# Altium project IMX8SoCIot.PrjPcb (part 1 of 9)
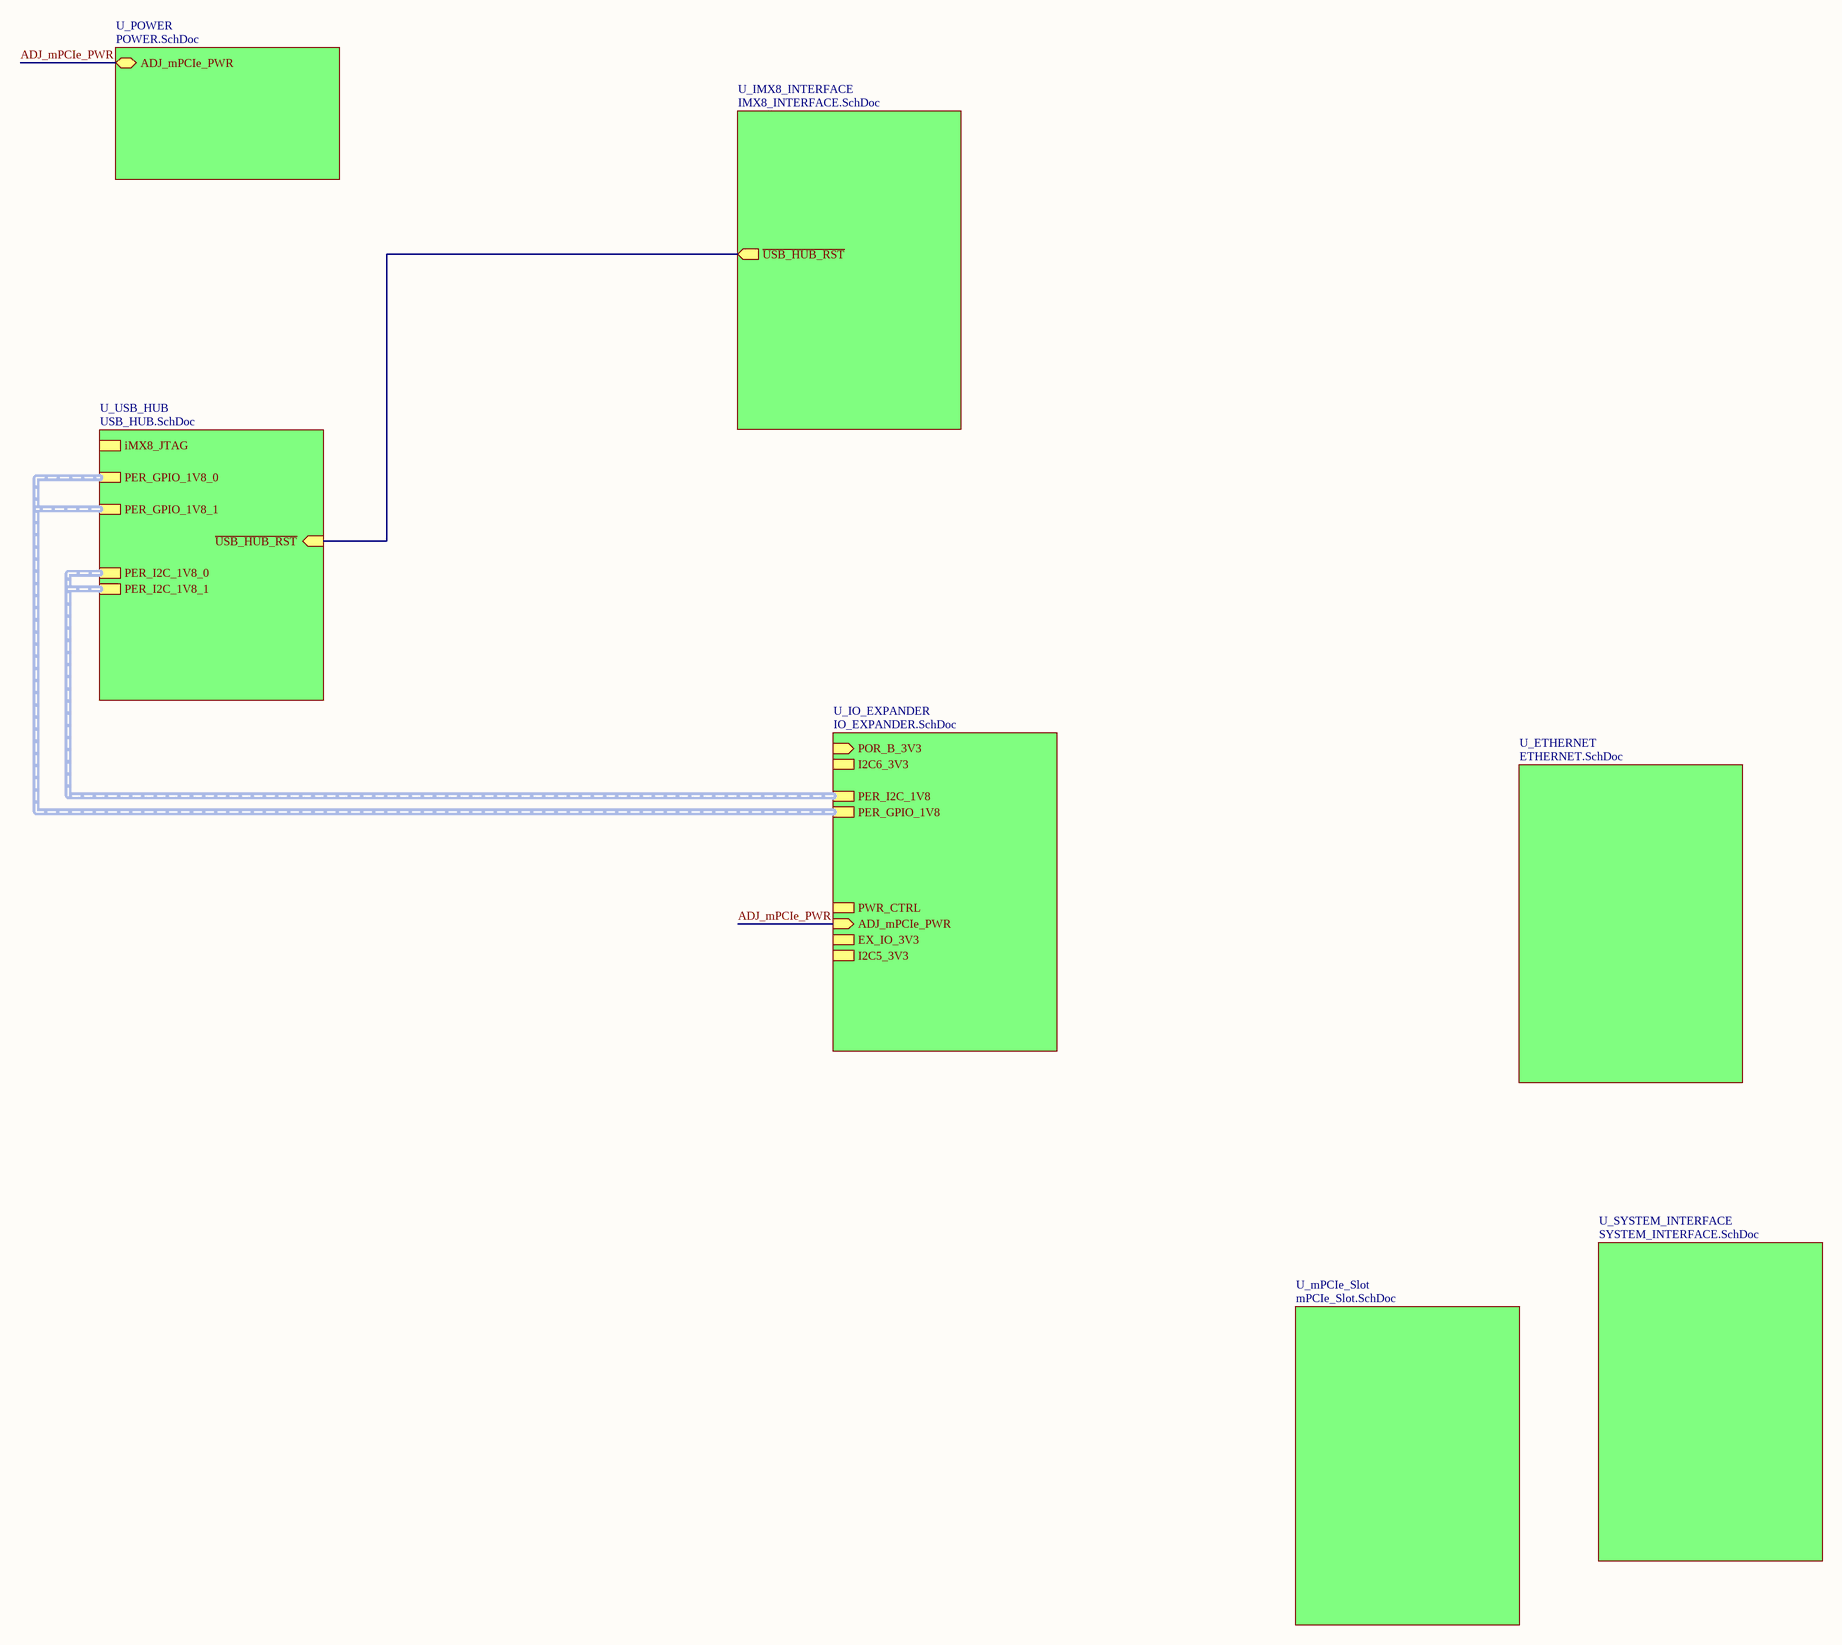
[diagram p0: TOP_LEVEL.SchDoc]
19 sheets, 753 parts. Net scope: global (net labels, ports and power ports of the same name join across sheets).
Board file: PCB1.PcbDoc
Sheets:
  TOP_LEVEL.SchDoc
    U_POWER = POWER.SchDoc
      U_SMPS = SMPS.SchDoc
    U_IMX8_INTERFACE = IMX8_INTERFACE.SchDoc
      U_IMX8_SOC = IMX8_SOC.SchDoc
        U_IMX8_DISPLAY = IMX8_DISPLAY.SchDoc
        U_IMX8_eMMC = IMX8_eMMC.SchDoc
        U_IMX8_IO = IMX8_IO.SchDoc
        U_IMX8_LPDDR4 = IMX8_LPDDR4.SchDoc
        U_IMX8_PHY = IMX8_PHY.SchDoc
        U_IMX8_PMIC = IMX8_PMIC.SchDoc
        U_IMX8_PWR = IMX8_PWR.SchDoc
    U_USB_HUB = USB_HUB.SchDoc
      U_USB_PER1 = USB_PER1.SchDoc
      U_USB_PER2 = USB_PER2.SchDoc
    U_IO_EXPANDER = IO_EXPANDER.SchDoc
    U_ETHERNET = ETHERNET.SchDoc
    U_SYSTEM_INTERFACE = SYSTEM_INTERFACE.SchDoc
    U_mPCIe_Slot = mPCIe_Slot.SchDoc

## Sheet TOP_LEVEL.SchDoc
size 594 x 420 mm; SheetNumber: 1; SheetTotal: 20

### Sub-sheets
U_ETHERNET = ETHERNET.SchDoc: no entries
U_IMX8_INTERFACE = IMX8_INTERFACE.SchDoc: ~{USB_HUB_RST} (out)
U_IO_EXPANDER = IO_EXPANDER.SchDoc: POR_B_3V3 (in), I2C6_3V3 (harness I2C6_3V3), PER_GPIO_1V8 (harness PER_GPIO_1V8), PER_I2C_1V8 (harness PER_I2C_1V8), PWR_CTRL (harness PWR_CTRL), ADJ_mPCIe_PWR (in), EX_IO_3V3 (harness EX_IO), I2C5_3V3 (harness I2C5_3V3)
U_mPCIe_Slot = mPCIe_Slot.SchDoc: no entries
U_POWER = POWER.SchDoc: ADJ_mPCIe_PWR (bidir)
U_SYSTEM_INTERFACE = SYSTEM_INTERFACE.SchDoc: no entries
U_USB_HUB = USB_HUB.SchDoc: iMX8_JTAG (harness iMX8_JTAG), PER_GPIO_1V8_0 (harness PER_GPIO_1V8_0), PER_GPIO_1V8_1 (harness PER_GPIO_1V8_1), PER_I2C_1V8_0 (harness PER_GPIO_1V8_0), PER_I2C_1V8_1 (harness PER_GPIO_1V8_1), ~{USB_HUB_RST} (in)

### Nets
ADJ_mPCIe_PWR: sheet U_POWER/ADJ_mPCIe_PWR, sheet U_IO_EXPANDER/ADJ_mPCIe_PWR
(unnamed): sheet U_IMX8_INTERFACE/~{USB_HUB_RST}, sheet U_USB_HUB/~{USB_HUB_RST}

### Buses and harness runs
harness sheet U_IO_EXPANDER/PER_GPIO_1V8 = sheet U_USB_HUB/PER_GPIO_1V8_0 = sheet U_USB_HUB/PER_GPIO_1V8_1
harness sheet U_IO_EXPANDER/PER_I2C_1V8 = sheet U_USB_HUB/PER_I2C_1V8_0 = sheet U_USB_HUB/PER_I2C_1V8_1

### Notes on the sheet
- DWG NO:
- REV:
- THIS DOCUMENT AND THE DATA DISCLOSED HEREIN OR
- HEREWITH IS THE PROPERTY OF ALTIUM LIMITED AND MAY
- BE FREELY DISTRIBUTED IN WHOLE. NO RIGHTS ARE
- RESERVED OR EXPRESS OR IMPLIED WARANTEE GIVEN.
- REVISION
- DESCRIPTION
- DATE
- APPROVED
- ENG:
- APPROVALS
- PROJECT
- DSN:
- CHK:
- REFERENCE DOCUMENTS
- PROJECT REVISION:
- TITLE
- DOCUMENT REVISION:
- DESIGN ITEM:
- BOM:
- FAB DWG:
- PCB DWG:
- ASSY DWG:
- SCALE:
- A2
- SIZE
- CAGE CODE
- FILE NAME
- DWG NO.
- SHEET
- OF
- REV

## Sheet POWER.SchDoc
size 594 x 420 mm; SheetNumber: 2; SheetTotal: 20
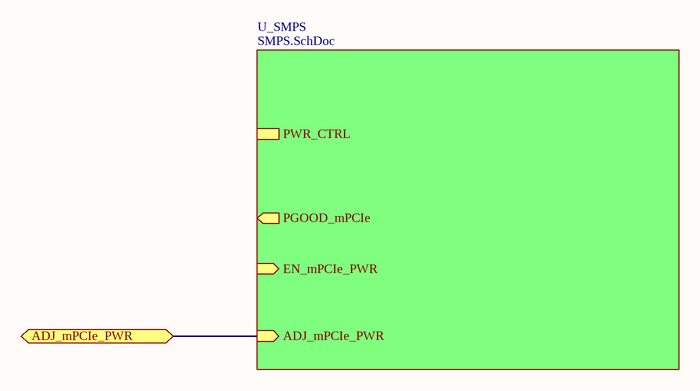
[diagram p1: POWER.SchDoc]

### Sub-sheets
U_SMPS = SMPS.SchDoc: PWR_CTRL (harness PWR_CTRL), PGOOD_mPCIe (out), EN_mPCIe_PWR (in), ADJ_mPCIe_PWR (in)

### Ports
ADJ_mPCIe_PWR (bidir)

### Nets
ADJ_mPCIe_PWR: port ADJ_mPCIe_PWR, sheet U_SMPS/ADJ_mPCIe_PWR

### Notes on the sheet
- DWG NO:
- REV:
- THIS DOCUMENT AND THE DATA DISCLOSED HEREIN OR
- HEREWITH IS THE PROPERTY OF ALTIUM LIMITED AND MAY
- BE FREELY DISTRIBUTED IN WHOLE. NO RIGHTS ARE
- RESERVED OR EXPRESS OR IMPLIED WARANTEE GIVEN.
- REVISION
- DESCRIPTION
- DATE
- APPROVED
- ENG:
- APPROVALS
- PROJECT
- DSN:
- CHK:
- REFERENCE DOCUMENTS
- PROJECT REVISION:
- TITLE
- DOCUMENT REVISION:
- DESIGN ITEM:
- BOM:
- FAB DWG:
- PCB DWG:
- ASSY DWG:
- SCALE:
- A2
- SIZE
- CAGE CODE
- FILE NAME
- DWG NO.
- SHEET
- OF
- REV

## Sheet SMPS.SchDoc
size 594 x 420 mm; SheetNumber: 3; SheetTotal: 20
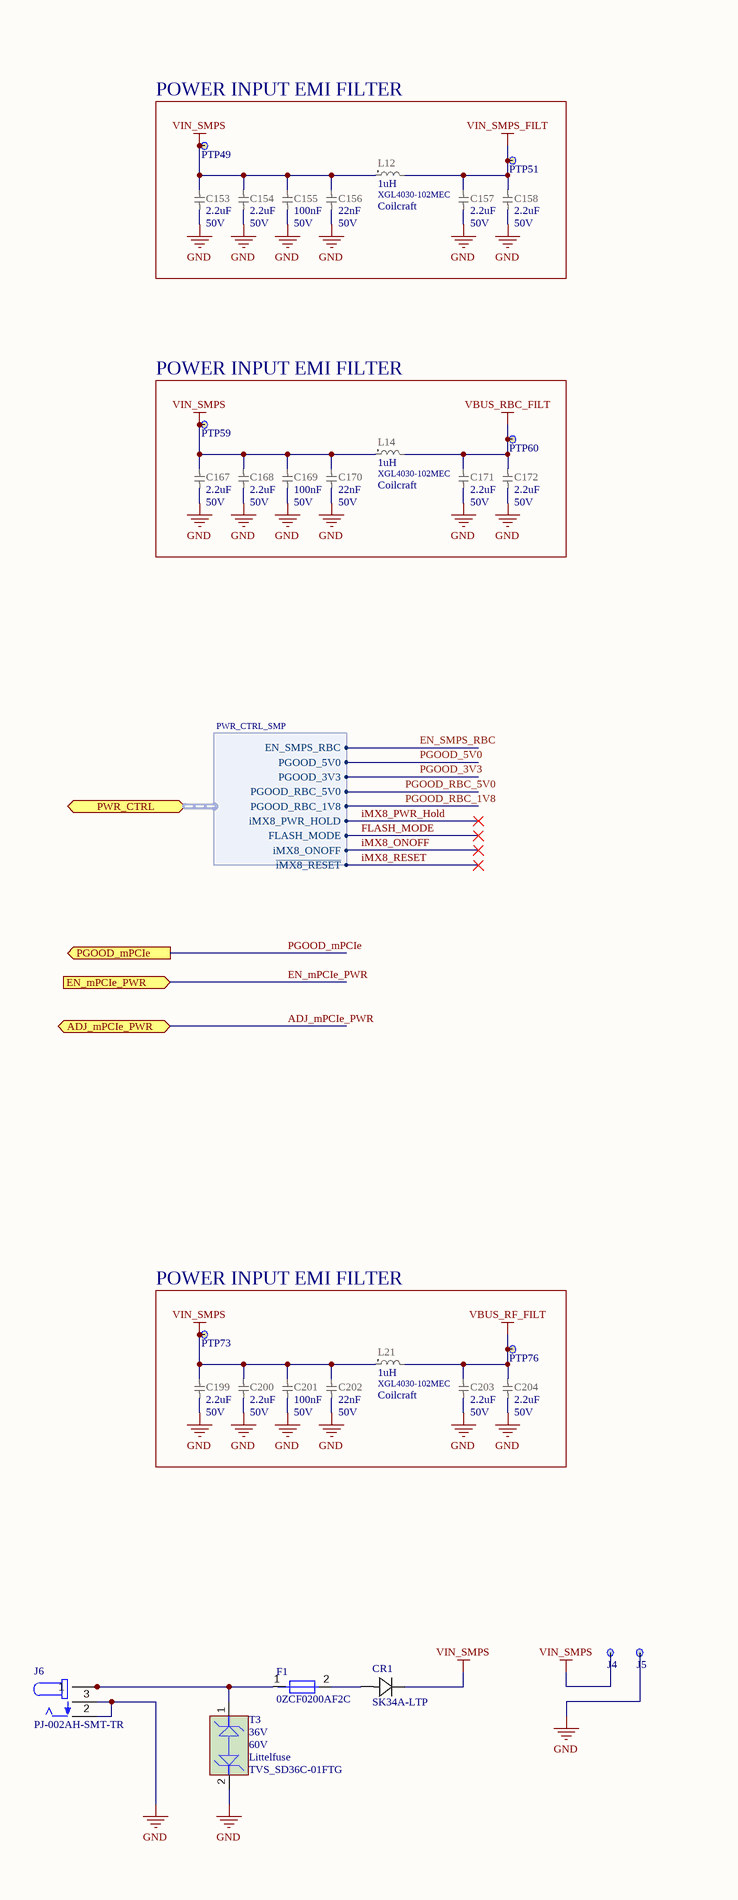
[diagram p2: SMPS.SchDoc, left]
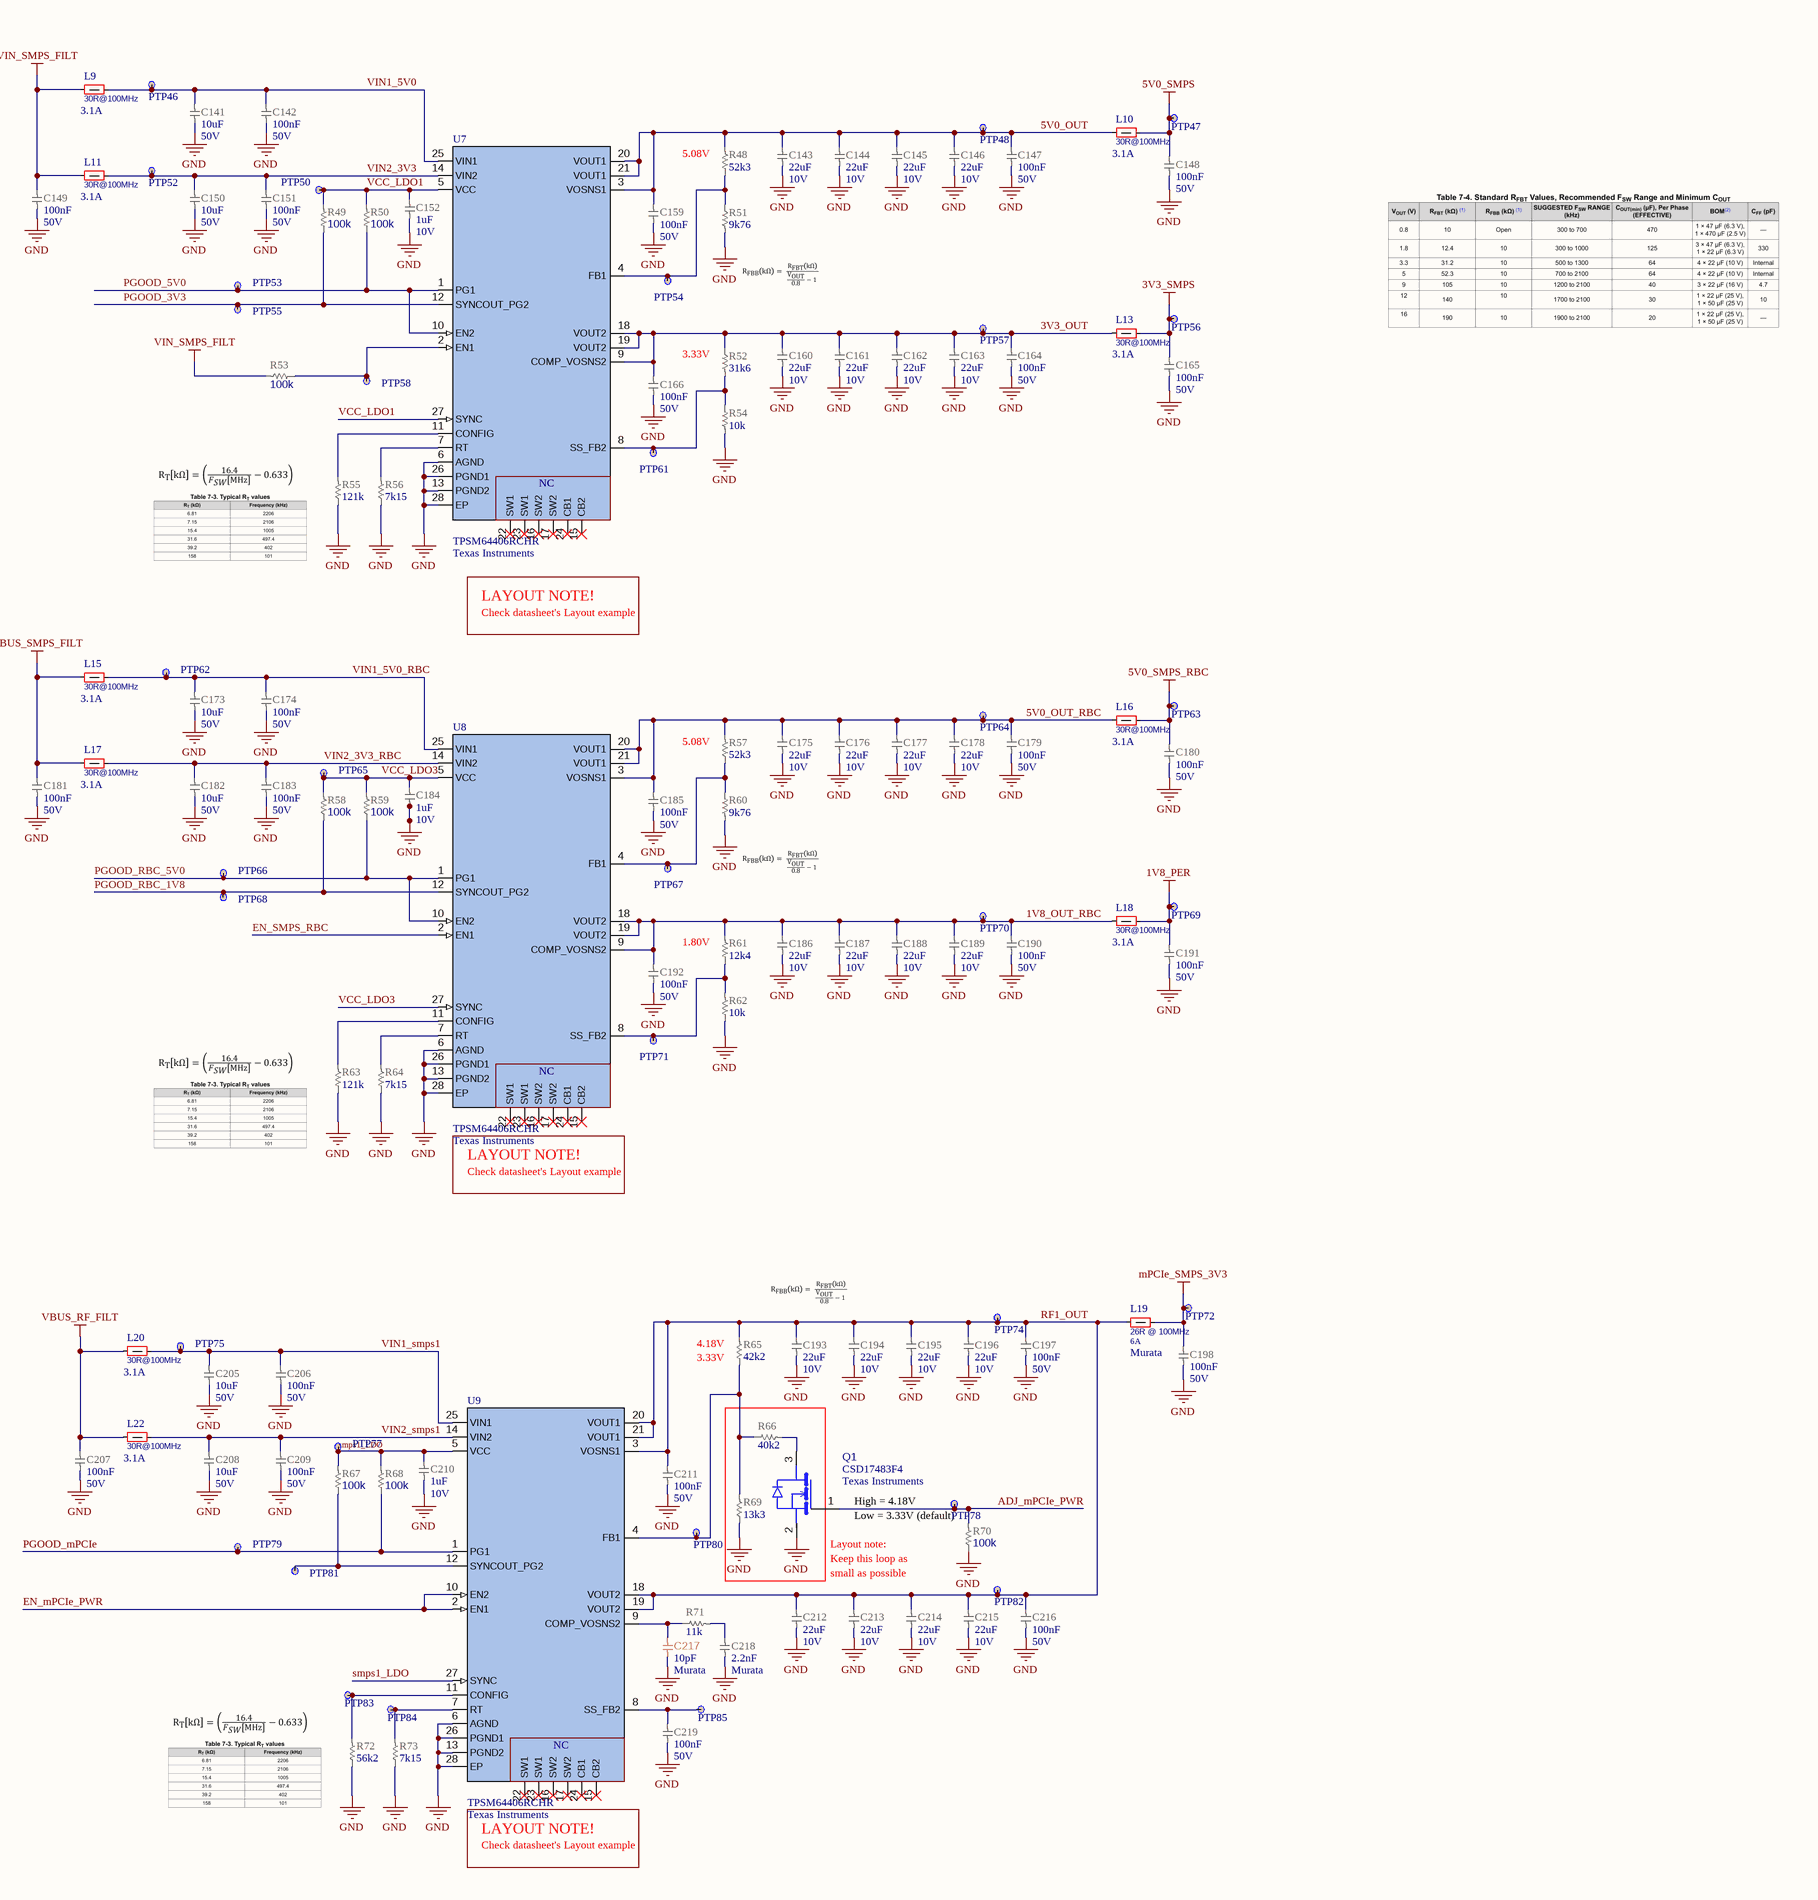
[diagram p3: SMPS.SchDoc, right]

### Parts
C141  value 10uF  Voltage: 50V  [CAP_1206_UN1Q]  (hidden comment: CAP_1206_10uF_X7R)
C142  value 100nF  Voltage: 50V  [CAP_0402_UN1Q]  (hidden comment: CAP_0402_100nF_50V)
C143  value 22uF  Voltage: 10V  [CAP_0805_UN1Q]  (hidden comment: CAP_0805_22uF_10V_X7R)
C144  value 22uF  Voltage: 10V  [CAP_0805_UN1Q]  (hidden comment: CAP_0805_22uF_10V_X7R)
C145  value 22uF  Voltage: 10V  [CAP_0805_UN1Q]  (hidden comment: CAP_0805_22uF_10V_X7R)
C146  value 22uF  Voltage: 10V  [CAP_0805_UN1Q]  (hidden comment: CAP_0805_22uF_10V_X7R)
C147  value 100nF  Voltage: 50V  [CAP_0402_UN1Q]  (hidden comment: CAP_0402_100nF_50V)
C148  value 100nF  Voltage: 50V  [CAP_0402_UN1Q]  (hidden comment: CAP_0402_100nF_50V)
C149  value 100nF  Voltage: 50V  [CAP_0402_UN1Q]  (hidden comment: CAP_0402_100nF_50V)
C150  value 10uF  Voltage: 50V  [CAP_1206_UN1Q]  (hidden comment: CAP_1206_10uF_X7R)
C151  value 100nF  Voltage: 50V  [CAP_0402_UN1Q]  (hidden comment: CAP_0402_100nF_50V)
C152  value 1uF  Voltage: 10V  [CAP_0201_UN1Q]  (hidden comment: CAP_0201_1uF_X6S)
C153  value 2.2uF  Voltage: 50V  [CAP_0805_UN1Q]  (hidden comment: CAP_0805_2u2_50V_X7R)
C154  value 2.2uF  Voltage: 50V  [CAP_0805_UN1Q]  (hidden comment: CAP_0805_2u2_50V_X7R)
C155  value 100nF  Voltage: 50V  [CAP_0402_UN1Q]  (hidden comment: CAP_0402_100nF_50V)
C156  value 22nF  Voltage: 50V  [CAP_0402_UN1Q]  (hidden comment: CAP_0402_22nF)
C157  value 2.2uF  Voltage: 50V  [CAP_0805_UN1Q]  (hidden comment: CAP_0805_2u2_50V_X7R)
C158  value 2.2uF  Voltage: 50V  [CAP_0805_UN1Q]  (hidden comment: CAP_0805_2u2_50V_X7R)
C159  value 100nF  Voltage: 50V  [CAP_0402_UN1Q]  (hidden comment: CAP_0402_100nF_50V)
C160  value 22uF  Voltage: 10V  [CAP_0805_UN1Q]  (hidden comment: CAP_0805_22uF_10V_X7R)
C161  value 22uF  Voltage: 10V  [CAP_0805_UN1Q]  (hidden comment: CAP_0805_22uF_10V_X7R)
C162  value 22uF  Voltage: 10V  [CAP_0805_UN1Q]  (hidden comment: CAP_0805_22uF_10V_X7R)
C163  value 22uF  Voltage: 10V  [CAP_0805_UN1Q]  (hidden comment: CAP_0805_22uF_10V_X7R)
C164  value 100nF  Voltage: 50V  [CAP_0402_UN1Q]  (hidden comment: CAP_0402_100nF_50V)
C165  value 100nF  Voltage: 50V  [CAP_0402_UN1Q]  (hidden comment: CAP_0402_100nF_50V)
C166  value 100nF  Voltage: 50V  [CAP_0402_UN1Q]  (hidden comment: CAP_0402_100nF_50V)
C167  value 2.2uF  Voltage: 50V  [CAP_0805_UN1Q]  (hidden comment: CAP_0805_2u2_50V_X7R)
C168  value 2.2uF  Voltage: 50V  [CAP_0805_UN1Q]  (hidden comment: CAP_0805_2u2_50V_X7R)
C169  value 100nF  Voltage: 50V  [CAP_0402_UN1Q]  (hidden comment: CAP_0402_100nF_50V)
C170  value 22nF  Voltage: 50V  [CAP_0402_UN1Q]  (hidden comment: CAP_0402_22nF)
C171  value 2.2uF  Voltage: 50V  [CAP_0805_UN1Q]  (hidden comment: CAP_0805_2u2_50V_X7R)
C172  value 2.2uF  Voltage: 50V  [CAP_0805_UN1Q]  (hidden comment: CAP_0805_2u2_50V_X7R)
C173  value 10uF  Voltage: 50V  [CAP_1206_UN1Q]  (hidden comment: CAP_1206_10uF_X7R)
C174  value 100nF  Voltage: 50V  [CAP_0402_UN1Q]  (hidden comment: CAP_0402_100nF_50V)
C175  value 22uF  Voltage: 10V  [CAP_0805_UN1Q]  (hidden comment: CAP_0805_22uF_10V_X7R)
C176  value 22uF  Voltage: 10V  [CAP_0805_UN1Q]  (hidden comment: CAP_0805_22uF_10V_X7R)
C177  value 22uF  Voltage: 10V  [CAP_0805_UN1Q]  (hidden comment: CAP_0805_22uF_10V_X7R)
C178  value 22uF  Voltage: 10V  [CAP_0805_UN1Q]  (hidden comment: CAP_0805_22uF_10V_X7R)
C179  value 100nF  Voltage: 50V  [CAP_0402_UN1Q]  (hidden comment: CAP_0402_100nF_50V)
C180  value 100nF  Voltage: 50V  [CAP_0402_UN1Q]  (hidden comment: CAP_0402_100nF_50V)
C181  value 100nF  Voltage: 50V  [CAP_0402_UN1Q]  (hidden comment: CAP_0402_100nF_50V)
C182  value 10uF  Voltage: 50V  [CAP_1206_UN1Q]  (hidden comment: CAP_1206_10uF_X7R)
C183  value 100nF  Voltage: 50V  [CAP_0402_UN1Q]  (hidden comment: CAP_0402_100nF_50V)
C184  value 1uF  Voltage: 10V  [CAP_0201_UN1Q]  (hidden comment: CAP_0201_1uF_X6S)
C185  value 100nF  Voltage: 50V  [CAP_0402_UN1Q]  (hidden comment: CAP_0402_100nF_50V)
C186  value 22uF  Voltage: 10V  [CAP_0805_UN1Q]  (hidden comment: CAP_0805_22uF_10V_X7R)
C187  value 22uF  Voltage: 10V  [CAP_0805_UN1Q]  (hidden comment: CAP_0805_22uF_10V_X7R)
C188  value 22uF  Voltage: 10V  [CAP_0805_UN1Q]  (hidden comment: CAP_0805_22uF_10V_X7R)
C189  value 22uF  Voltage: 10V  [CAP_0805_UN1Q]  (hidden comment: CAP_0805_22uF_10V_X7R)
C190  value 100nF  Voltage: 50V  [CAP_0402_UN1Q]  (hidden comment: CAP_0402_100nF_50V)
C191  value 100nF  Voltage: 50V  [CAP_0402_UN1Q]  (hidden comment: CAP_0402_100nF_50V)
C192  value 100nF  Voltage: 50V  [CAP_0402_UN1Q]  (hidden comment: CAP_0402_100nF_50V)
C193  value 22uF  Voltage: 10V  [CAP_0805_UN1Q]  (hidden comment: CAP_0805_22uF_10V_X7R)
C194  value 22uF  Voltage: 10V  [CAP_0805_UN1Q]  (hidden comment: CAP_0805_22uF_10V_X7R)
C195  value 22uF  Voltage: 10V  [CAP_0805_UN1Q]  (hidden comment: CAP_0805_22uF_10V_X7R)
C196  value 22uF  Voltage: 10V  [CAP_0805_UN1Q]  (hidden comment: CAP_0805_22uF_10V_X7R)
C197  value 100nF  Voltage: 50V  [CAP_0402_UN1Q]  (hidden comment: CAP_0402_100nF_50V)
C198  value 100nF  Voltage: 50V  [CAP_0402_UN1Q]  (hidden comment: CAP_0402_100nF_50V)
C199  value 2.2uF  Voltage: 50V  [CAP_0805_UN1Q]  (hidden comment: CAP_0805_2u2_50V_X7R)
C200  value 2.2uF  Voltage: 50V  [CAP_0805_UN1Q]  (hidden comment: CAP_0805_2u2_50V_X7R)
C201  value 100nF  Voltage: 50V  [CAP_0402_UN1Q]  (hidden comment: CAP_0402_100nF_50V)
C202  value 22nF  Voltage: 50V  [CAP_0402_UN1Q]  (hidden comment: CAP_0402_22nF)
C203  value 2.2uF  Voltage: 50V  [CAP_0805_UN1Q]  (hidden comment: CAP_0805_2u2_50V_X7R)
C204  value 2.2uF  Voltage: 50V  [CAP_0805_UN1Q]  (hidden comment: CAP_0805_2u2_50V_X7R)
C205  value 10uF  Voltage: 50V  [CAP_1206_UN1Q]  (hidden comment: CAP_1206_10uF_X7R)
C206  value 100nF  Voltage: 50V  [CAP_0402_UN1Q]  (hidden comment: CAP_0402_100nF_50V)
C207  value 100nF  Voltage: 50V  [CAP_0402_UN1Q]  (hidden comment: CAP_0402_100nF_50V)
C208  value 10uF  Voltage: 50V  [CAP_1206_UN1Q]  (hidden comment: CAP_1206_10uF_X7R)
C209  value 100nF  Voltage: 50V  [CAP_0402_UN1Q]  (hidden comment: CAP_0402_100nF_50V)
C210  value 1uF  Voltage: 10V  [CAP_0201_UN1Q]  (hidden comment: CAP_0201_1uF_X6S)
C211  value 100nF  Voltage: 50V  [CAP_0402_UN1Q]  (hidden comment: CAP_0402_100nF_50V)
C212  value 22uF  Voltage: 10V  [CAP_0805_UN1Q]  (hidden comment: CAP_0805_22uF_10V_X7R)
C213  value 22uF  Voltage: 10V  [CAP_0805_UN1Q]  (hidden comment: CAP_0805_22uF_10V_X7R)
C214  value 22uF  Voltage: 10V  [CAP_0805_UN1Q]  (hidden comment: CAP_0805_22uF_10V_X7R)
C215  value 22uF  Voltage: 10V  [CAP_0805_UN1Q]  (hidden comment: CAP_0805_22uF_10V_X7R)
C216  value 100nF  Voltage: 50V  [CAP_0402_UN1Q]  (hidden comment: CAP_0402_100nF_50V)
C217  value 10pF  Manufacturer: Murata  [CAP_0201_UN1Q]  (hidden comment: CAP_0201_10pF_RF_MATCHING)
C218  value 2.2nF  Manufacturer: Murata  [CAP_0201_UN1Q]  (hidden comment: CAP_0201_2n2)
C219  value 100nF  Voltage: 50V  [CAP_0402_UN1Q]  (hidden comment: CAP_0402_100nF_50V)
CR1  SK34A-LTP  [SMADO-214AC_MCC]
F1  0ZCF0200AF2C  [FUSE_0ZCF0075AF2C]
J4  PAD 1 x 2 mm  [TP_1x2mm_UN1Q]  (value not drawn)  (no BOM)
J5  PAD 1 x 2 mm  [TP_1x2mm_UN1Q]  (value not drawn)  (no BOM)
J6  PJ-002AH-SMT-TR  [CUI_PJ-002AH-SMT-TR]
L9  value 30R@100MHz  Current: 3.1A  [FERR_BLM15KD]  (hidden comment: FERRITE_0402_BLM15KD)
L10  value 30R@100MHz  Current: 3.1A  [FERR_BLM15KD]  (hidden comment: FERRITE_0402_BLM15KD)
L11  value 30R@100MHz  Current: 3.1A  [FERR_BLM15KD]  (hidden comment: FERRITE_0402_BLM15KD)
L12  value 1uH  Part Number: XGL4030-102MEC  Manufacturer: Coilcraft  [IND_XGL4030]  (hidden comment: IND_XGL4030_1u)
L13  value 30R@100MHz  Current: 3.1A  [FERR_BLM15KD]  (hidden comment: FERRITE_0402_BLM15KD)
L14  value 1uH  Part Number: XGL4030-102MEC  Manufacturer: Coilcraft  [IND_XGL4030]  (hidden comment: IND_XGL4030_1u)
L15  value 30R@100MHz  Current: 3.1A  [FERR_BLM15KD]  (hidden comment: FERRITE_0402_BLM15KD)
L16  value 30R@100MHz  Current: 3.1A  [FERR_BLM15KD]  (hidden comment: FERRITE_0402_BLM15KD)
L17  value 30R@100MHz  Current: 3.1A  [FERR_BLM15KD]  (hidden comment: FERRITE_0402_BLM15KD)
L18  value 30R@100MHz  Current: 3.1A  [FERR_BLM15KD]  (hidden comment: FERRITE_0402_BLM15KD)
L19  value 26R @ 100MHz  Current: 6A  Manufacturer: Murata  [IND_0603_UN1Q]  (hidden comment: FERRITE_0603_BLM18_6A)
L20  value 30R@100MHz  Current: 3.1A  [FERR_BLM15KD]  (hidden comment: FERRITE_0402_BLM15KD)
L21  value 1uH  Part Number: XGL4030-102MEC  Manufacturer: Coilcraft  [IND_XGL4030]  (hidden comment: IND_XGL4030_1u)
L22  value 30R@100MHz  Current: 3.1A  [FERR_BLM15KD]  (hidden comment: FERRITE_0402_BLM15KD)
PTP46  PTP_0.4mm  [PTP_0.4mm]  (value not drawn)  (no BOM)
PTP47  PTP_0.4mm  [PTP_0.4mm]  (value not drawn)  (no BOM)
PTP48  PTP_0.4mm  [PTP_0.4mm]  (value not drawn)  (no BOM)
PTP49  PTP_0.4mm  [PTP_0.4mm]  (value not drawn)  (no BOM)
PTP50  PTP_0.4mm  [PTP_0.4mm]  (value not drawn)  (no BOM)
PTP51  PTP_0.4mm  [PTP_0.4mm]  (value not drawn)  (no BOM)
PTP52  PTP_0.4mm  [PTP_0.4mm]  (value not drawn)  (no BOM)
PTP53  PTP_0.4mm  [PTP_0.4mm]  (value not drawn)  (no BOM)
PTP54  PTP_0.4mm  [PTP_0.4mm]  (value not drawn)  (no BOM)
PTP55  PTP_0.4mm  [PTP_0.4mm]  (value not drawn)  (no BOM)
PTP56  PTP_0.4mm  [PTP_0.4mm]  (value not drawn)  (no BOM)
PTP57  PTP_0.4mm  [PTP_0.4mm]  (value not drawn)  (no BOM)
PTP58  PTP_0.4mm  [PTP_0.4mm]  (value not drawn)  (no BOM)
PTP59  PTP_0.4mm  [PTP_0.4mm]  (value not drawn)  (no BOM)
PTP60  PTP_0.4mm  [PTP_0.4mm]  (value not drawn)  (no BOM)
PTP61  PTP_0.4mm  [PTP_0.4mm]  (value not drawn)  (no BOM)
PTP62  PTP_0.4mm  [PTP_0.4mm]  (value not drawn)  (no BOM)
PTP63  PTP_0.4mm  [PTP_0.4mm]  (value not drawn)  (no BOM)
PTP64  PTP_0.4mm  [PTP_0.4mm]  (value not drawn)  (no BOM)
PTP65  PTP_0.4mm  [PTP_0.4mm]  (value not drawn)  (no BOM)
PTP66  PTP_0.4mm  [PTP_0.4mm]  (value not drawn)  (no BOM)
PTP67  PTP_0.4mm  [PTP_0.4mm]  (value not drawn)  (no BOM)
PTP68  PTP_0.4mm  [PTP_0.4mm]  (value not drawn)  (no BOM)
PTP69  PTP_0.4mm  [PTP_0.4mm]  (value not drawn)  (no BOM)
PTP70  PTP_0.4mm  [PTP_0.4mm]  (value not drawn)  (no BOM)
PTP71  PTP_0.4mm  [PTP_0.4mm]  (value not drawn)  (no BOM)
PTP72  PTP_0.4mm  [PTP_0.4mm]  (value not drawn)  (no BOM)
PTP73  PTP_0.4mm  [PTP_0.4mm]  (value not drawn)  (no BOM)
PTP74  PTP_0.4mm  [PTP_0.4mm]  (value not drawn)  (no BOM)
PTP75  PTP_0.4mm  [PTP_0.4mm]  (value not drawn)  (no BOM)
PTP76  PTP_0.4mm  [PTP_0.4mm]  (value not drawn)  (no BOM)
PTP77  PTP_0.4mm  [PTP_0.4mm]  (value not drawn)  (no BOM)
PTP78  PTP_0.4mm  [PTP_0.4mm]  (value not drawn)  (no BOM)
PTP79  PTP_0.4mm  [PTP_0.4mm]  (value not drawn)  (no BOM)
PTP80  PTP_0.4mm  [PTP_0.4mm]  (value not drawn)  (no BOM)
PTP81  PTP_0.4mm  [PTP_0.4mm]  (value not drawn)  (no BOM)
PTP82  PTP_0.4mm  [PTP_0.4mm]  (value not drawn)  (no BOM)
PTP83  PTP_0.4mm  [PTP_0.4mm]  (value not drawn)  (no BOM)
PTP84  PTP_0.4mm  [PTP_0.4mm]  (value not drawn)  (no BOM)
PTP85  PTP_0.4mm  [PTP_0.4mm]  (value not drawn)  (no BOM)
Q1  Manufacturer: Texas Instruments  [3-PICOSTAR_TI]  (hidden comment: CSD17483F4)
R48  value 52k3  [RES_0201_UN1Q]  (hidden comment: RES_0201_52k3)
R49  value 100k  [RES_0201_UN1Q]  (hidden comment: RES_0201_100k)
R50  value 100k  [RES_0201_UN1Q]  (hidden comment: RES_0201_100k)
R51  value 9k76  [RES_0201_UN1Q]  (hidden comment: RES_0201_9k76)
R52  value 31k6  [RES_0201_UN1Q]  (hidden comment: RES_0201_31k6)
R53  value 100k  [RES_0201_UN1Q]  (hidden comment: RES_0201_100k)
R54  value 10k  [RES_0201_UN1Q]  (hidden comment: RES_0201_10k)
R55  value 121k  [RES_0201_UN1Q]  (hidden comment: RES_0201_121k)
R56  value 7k15  [RES_0201_UN1Q]  (hidden comment: RES_0201_7k15)
R57  value 52k3  [RES_0201_UN1Q]  (hidden comment: RES_0201_52k3)
R58  value 100k  [RES_0201_UN1Q]  (hidden comment: RES_0201_100k)
R59  value 100k  [RES_0201_UN1Q]  (hidden comment: RES_0201_100k)
R60  value 9k76  [RES_0201_UN1Q]  (hidden comment: RES_0201_9k76)
R61  value 12k4  [RES_0201_UN1Q]  (hidden comment: RES_0201_12k4)
R62  value 10k  [RES_0201_UN1Q]  (hidden comment: RES_0201_10k)
R63  value 121k  [RES_0201_UN1Q]  (hidden comment: RES_0201_121k)
R64  value 7k15  [RES_0201_UN1Q]  (hidden comment: RES_0201_7k15)
R65  value 42k2  [RES_0201_UN1Q]  (hidden comment: RES_0201_42k2)
R66  value 40k2  [RES_0201_UN1Q]  (hidden comment: RES_0201_40k2)
R67  value 100k  [RES_0201_UN1Q]  (hidden comment: RES_0201_100k)
R68  value 100k  [RES_0201_UN1Q]  (hidden comment: RES_0201_100k)
R69  value 13k3  [RES_0201_UN1Q]  (hidden comment: RES_0201_13k3)
R70  value 100k  [RES_0201_UN1Q]  (hidden comment: RES_0201_100k)
R71  value 11k  [RES_0201_UN1Q]  (hidden comment: RES_0201_11k)
R72  value 56k2  [RES_0201_UN1Q]  (hidden comment: RES_0201_56k2)
R73  value 7k15  [RES_0201_UN1Q]  (hidden comment: RES_0201_7k15)
T3  TVS_SD36C-01FTG  value 36V  Voltage: 60V  Manufacturer: Littelfuse  [SOD-323]
U7  Manufacturer: Texas Instruments  [QFN-FCMOD-28_TI]  (hidden comment: TPSM64406RCHR)
U8  Manufacturer: Texas Instruments  [QFN-FCMOD-28_TI]  (hidden comment: TPSM64406RCHR)
U9  Manufacturer: Texas Instruments  [QFN-FCMOD-28_TI]  (hidden comment: TPSM64406RCHR)

### Blocks framed on the sheet
POWER INPUT EMI FILTER: C153-C158 L12 PTP49 PTP51
POWER INPUT EMI FILTER: C167-C172 L14 PTP59 PTP60
POWER INPUT EMI FILTER: C199-C204 L21 PTP73 PTP76

### Ports
ADJ_mPCIe_PWR (bidir), EN_mPCIe_PWR (in), PGOOD_mPCIe (out), PWR_CTRL (bidir, harness PWR_CTRL_SMP)

### Harnesses
PWR_CTRL_SMP: PGOOD_3V3, FLASH_MODE, PGOOD_RBC_1V8, PGOOD_5V0, iMX8_ONOFF, ~{iMX8_RESET}, EN_SMPS_RBC, iMX8_PWR_HOLD, PGOOD_RBC_5V0

### Nets
1V8_PER: C191.2 L18.2 PTP69.1(TP)
3V3_SMPS: C165.2 L13.2 PTP56.1(TP)
5V0_SMPS: C148.2 L10.2 PTP47.1(TP)
5V0_SMPS_RBC: C180.2 L16.2 PTP63.1(TP)
GND: C141.1 C142.2 C143.2 C144.2 C145.2 C146.2 C147.2 C148.1 C149.2 C150.1 C151.2 C152.2 C153.1 C154.1 C155.2 C156.2 C157.1 C158.1 C159.2 C160.2 C161.2 C162.2 C163.2 C164.2 C165.1 C166.2 C167.1 C168.1 C169.2 C170.2 C171.1 C172.1 C173.1 C174.1 C175.2 C176.2 C177.2 C178.2 C179.2 C180.1 C181.2 C182.1 C183.1 C184.2 C185.2 C186.2 C187.2 C188.2 C189.2 C190.2 C191.1 C192.2 C193.2 C194.2 C195.2 C196.2 C197.2 C198.1 C199.1 C200.1 C201.2 C202.2 C203.1 C204.1 C205.1 C206.1 C207.2 C208.1 C209.1 C210.2 C211.2 C212.2 C213.2 C214.2 C215.2 C216.2 C217.2 C218.1 C219.2 J5.1(TP) J6.2 J6.3 Q1.2(S) R51.2 R54.2 R55.1 R56.1 R60.2 R62.1 R63.1 R64.1 R69.1 R70.1 R72.1 R73.1 T3.2 U7.6(AGND) U7.13(PGND2) U7.26(PGND1) U7.28(EP) U8.6(AGND) U8.13(PGND2) U8.26(PGND1) U8.28(EP) U9.6(AGND) U9.13(PGND2) U9.26(PGND1) U9.28(EP)
mPCIe_SMPS_3V3: C198.2 L19.2 PTP72.1(TP)
VBUS_RBC_FILT: C171.2 C172.2 L14.2 PTP60.1(TP)
VBUS_RF_FILT: C203.2 C204.2 C207.1 L20.1 L21.2 L22.1 PTP76.1(TP)
VBUS_SMPS_FILT: C181.1 L15.1 L17.1
VIN_SMPS: C153.2 C154.2 C155.1 C156.1 C167.2 C168.2 C169.1 C170.1 C199.2 C200.2 C201.1 C202.1 CR1.1(CATHODE) J4.1(TP) L12.1 L14.1 L21.1 PTP49.1(TP) PTP59.1(TP) PTP73.1(TP)
VIN_SMPS_FILT: C149.1 C157.2 C158.2 L9.1 L11.1 L12.2 PTP51.1(TP) R53.2
1V8_OUT_RBC: C186.1 C187.1 C188.1 C189.1 C190.1 C192.1 L18.1 PTP70.1(TP) R61.2 U8.9(COMP_VOSNS2) U8.18(VOUT2) U8.19(VOUT2)
3V3_OUT: C160.1 C161.1 C162.1 C163.1 C164.1 C166.1 L13.1 PTP57.1(TP) R52.1 U7.9(COMP_VOSNS2) U7.18(VOUT2) U7.19(VOUT2)
5V0_OUT: C143.1 C144.1 C145.1 C146.1 C147.1 C159.1 L10.1 PTP48.1(TP) R48.2 U7.3(VOSNS1) U7.20(VOUT1) U7.21(VOUT1)
5V0_OUT_RBC: C175.1 C176.1 C177.1 C178.1 C179.1 C185.1 L16.1 PTP64.1(TP) R57.2 U8.3(VOSNS1) U8.20(VOUT1) U8.21(VOUT1)
ADJ_mPCIe_PWR: PTP78.1(TP) Q1.1(G) R70.2 ; port ADJ_mPCIe_PWR
EN_mPCIe_PWR: U9.2(EN1) U9.10(EN2) ; port EN_mPCIe_PWR
EN_SMPS_RBC: U8.2(EN1) ; port PWR_CTRL.EN_SMPS_RBC
FLASH_MODE: port PWR_CTRL.FLASH_MODE
iMX8_ONOFF: port PWR_CTRL.iMX8_ONOFF
iMX8_PWR_Hold: port PWR_CTRL.iMX8_PWR_HOLD
iMX8_RESET: port PWR_CTRL.~{iMX8_RESET}
PGOOD_3V3: PTP55.1(TP) R49.1 U7.12(SYNCOUT_PG2) ; port PWR_CTRL.PGOOD_3V3
PGOOD_5V0: PTP53.1(TP) R50.1 U7.1(PG1) U7.10(EN2) ; port PWR_CTRL.PGOOD_5V0
PGOOD_mPCIe: PTP79.1(TP) R68.1 U9.1(PG1) ; port PGOOD_mPCIe
PGOOD_RBC_1V8: PTP68.1(TP) R58.1 U8.12(SYNCOUT_PG2) ; port PWR_CTRL.PGOOD_RBC_1V8
PGOOD_RBC_5V0: PTP66.1(TP) R59.1 U8.1(PG1) U8.10(EN2) ; port PWR_CTRL.PGOOD_RBC_5V0
RF1_OUT: C193.1 C194.1 C195.1 C196.1 C197.1 C211.1 C212.1 C213.1 C214.1 C215.1 C216.1 L19.1 PTP74.1(TP) PTP82.1(TP) R65.2 U9.3(VOSNS1) U9.18(VOUT2) U9.19(VOUT2) U9.20(VOUT1) U9.21(VOUT1)
smps1_LDO: C210.1 PTP77.1(TP) R67.2 R68.2 U9.5(VCC) U9.27(SYNC)
VCC_LDO1: C152.1 PTP50.1(TP) R49.2 R50.2 U7.5(VCC) U7.27(SYNC)
VCC_LDO3: C184.1 PTP65.1(TP) R58.2 R59.2 U8.5(VCC) U8.27(SYNC)
VIN1_5V0: C141.2 C142.1 L9.2 PTP46.1(TP) U7.25(VIN1)
VIN1_5V0_RBC: C173.2 C174.2 L15.2 PTP62.1(TP) U8.25(VIN1)
VIN1_smps1: C205.2 C206.2 L20.2 PTP75.1(TP) U9.25(VIN1)
VIN2_3V3: C150.2 C151.1 L11.2 PTP52.1(TP) U7.14(VIN2)
VIN2_3V3_RBC: C182.2 C183.2 L17.2 U8.14(VIN2)
VIN2_smps1: C208.2 C209.2 L22.2 U9.14(VIN2)
NetC217_1: C217.1 R71.1 U9.9(COMP_VOSNS2)
NetC218_2: C218.2 R71.2
NetC219_1: C219.1 PTP85.1(TP) U9.8(SS_FB2)
NetCR1_2: CR1.2(ANODE) F1.2
NetF1_1: F1.1 J6.1A J6.1B(1) T3.1
NetPTP54_1: PTP54.1(TP) R48.1 R51.1 U7.4(FB1)
NetPTP58_1: PTP58.1(TP) R53.1 U7.2(EN1)
NetPTP61_1: PTP61.1(TP) R52.2 R54.1 U7.8(SS_FB2)
NetPTP67_1: PTP67.1(TP) R57.1 R60.1 U8.4(FB1)
NetPTP71_1: PTP71.1(TP) R61.1 R62.2 U8.8(SS_FB2)
NetPTP80_1: PTP80.1(TP) R65.1 R66.1 R69.2 U9.4(FB1)
NetPTP81_1: PTP81.1(TP) R67.1 U9.12(SYNCOUT_PG2)
NetPTP83_1: PTP83.1(TP) R72.2 U9.11(CONFIG)
NetPTP84_1: PTP84.1(TP) R73.2 U9.7(RT)
NetQ1_3: Q1.3(D) R66.2
NetR55_2: R55.2 U7.11(CONFIG)
NetR56_2: R56.2 U7.7(RT)
NetR63_2: R63.2 U8.11(CONFIG)
NetR64_2: R64.2 U8.7(RT)

Not connected (* = marked no-connect by the designer): U7 15(CB2)* 16(SW2)* 17(SW2)* 22(SW1)* 23(SW1)* 24(CB1)*; U8 15(CB2)* 16(SW2)* 17(SW2)* 22(SW1)* 23(SW1)* 24(CB1)*; U9 15(CB2)* 16(SW2)* 17(SW2)* 22(SW1)* 23(SW1)* 24(CB1)*

### Notes on the sheet
- (near R48) 5.08V
- (near R52) 3.33V
- LAYOUT NOTE!
- Check datasheet's Layout example
- (near R57) 5.08V
- (near R61) 1.80V
- (near U8) LAYOUT NOTE!
- (near R65) 4.18V
- (near R65) 3.33V
- High = 4.18V
- Low = 3.33V (default)
- (near Q1) Layout note:
- Keep this loop as
- small as possible
- (near U9) LAYOUT NOTE!
- DWG NO:
- REV:
- THIS DOCUMENT AND THE DATA DISCLOSED HEREIN OR
- HEREWITH IS THE PROPERTY OF ALTIUM LIMITED AND MAY
- BE FREELY DISTRIBUTED IN WHOLE. NO RIGHTS ARE
- RESERVED OR EXPRESS OR IMPLIED WARANTEE GIVEN.
- REVISION
- DESCRIPTION
- DATE
- APPROVED
- ENG:
- APPROVALS
- PROJECT
- DSN:
- CHK:
- REFERENCE DOCUMENTS
- PROJECT REVISION:
- TITLE
- DOCUMENT REVISION:
- DESIGN ITEM:
- BOM:
- FAB DWG:
- PCB DWG:
- ASSY DWG:
- SCALE:
- A2
- SIZE
- CAGE CODE
- FILE NAME
- DWG NO.
- SHEET
- OF
- REV
- (in symbol CMP-001-001142-13) NC

### Library data of the parts
C141 C150 C173 C182 C205 C208 = CMP-001-000368-12: CAP; Part Number: CL31B106KBHNNNE; Manufacturer: Samsung; Temperature characteristics: X7R; Tolerance: +/-10%; Sort order: 308; HasBeenBuilt: Saluki3; Alternative component: Allowed; System: RLC; Package: 1206; Operating temperature range: -55 ... +125°C; ComponentLink1Description: 1_Datasheet; ComponentLink2Description: 2_Product page; ComponentLink3Description: 3_X-information; ComponentLink4Description: 4_X-information; Creation date: 20220729; ECCN: EAR99; Source: RLC_UN1Q.SchLib; RoHS: ROHS3; Manufacturer Part Number: CL31B106KBHNNNE; Component Type: Capacitor
C142 C147-C149 C151 C155 C159 C164-C166 C169 C174 C179-C181 C183 C185 C190-C192 C197 C198 C201 C206 C207 C209 C211 C216 C219 = CMP-001-000371-14: CAP; Part Number: GRM155R71H104KE14D; Manufacturer: Murata; Temperature characteristics: X7R; Tolerance: +/-10%; Sort order: 304; HasBeenBuilt: TBD; Alternative component: Allowed; System: RLC; Package: 0402; ComponentLink1Description: 1_Datasheet; ComponentLink2Description: 2_Product page; ComponentLink3Description: 3_X-information; ComponentLink4Description: 4_X-information; Creation date: 20190101; Manufacturer Part Number: GRM155R71H104KE14D; Component Type: Capacitor
C143-C146 C160-C163 C175-C178 C186-C189 C193-C196 C212-C215 = CMP-001-000892-11: CAP; Part Number: GRM21BZ71A226ME15L; Manufacturer: Murata; Tolerance: +/-20%; Alternative component: Allowed; Sort order: 308; Temperature characteristics: X7R; System: RLC; HasBeenBuilt: TBD; Creation date: 22032024; ComponentLink4Description: 4_X-information; ComponentLink1Description: 1_Datasheet; ComponentLink3Description: 3_X-information; ComponentLink2Description: 2_Product page; Package: 0805; Manufacturer Part Number: GRM21BZ71A226ME15L; Component Type: Capacitor
C152 C184 C210 = CMP-001-000336-15: CAP; Part Number: KGM03CS61A105MH; Manufacturer: Kyocera; Manufacturer: Kyocera AVX; Temperature characteristics: X6S; Tolerance: +/-20%; Sort order: 302; HasBeenBuilt: False; Alternative component: Allowed; System: RLC; Package: 0201; Operating temperature range: -55C to +105C; ClassName: SMALL; ComponentLink1Description: 1_Datasheet; ComponentLink2Description: 2_Product page; ComponentLink3Description: 3_X-information; ComponentLink4Description: 4_X-information; Creation date: 20190101; Source: RLC_UN1Q.SchLib; Manufacturer Part Number: KGM03CS61A105MH; Component Type: Capacitor
C153 C154 C157 C158 C167 C168 C171 C172 C199 C200 C203 C204 = CMP-001-000383-12: CAP; Manufacturer: TDK; Part Number: C2012X7R1H225K125AC; Temperature characteristics: X7R; System: RLC; Tolerance: +/-10%; Alternative component: Allowed; Sort order: 308; HasBeenBuilt: Saluki3; Creation date: 20220803; ComponentLink2Description: 2_Product page; Operating temperature range: -55 ... +125°C; ComponentLink4Description: 4_X-information; ComponentLink3Description: 3_X-information; RoHS: ROHS3; ComponentLink1Description: 1_Datasheet; Source: RLC_UN1Q.SchLib; Package: 0805; ECCN: EAR99; Manufacturer Part Number: C2012X7R1H225K125AC; Component Type: Capacitor
C156 C170 C202 = CMP-001-000321-12: CAP; Part Number: GCM155R71H223KA55D; Manufacturer: Murata; Temperature characteristics: X7R; Sort order: 304; System: RLC; HasBeenBuilt: False; Tolerance: +/-10%; Alternative component: Allowed; ECCN: EAR99; Creation date: 20210916; ComponentLink1Description: 1_Datasheet; Source: RLC_UN1Q.SchLib; ComponentLink4Description: 4_X-information; ComponentLink2Description: 2_Product page; RoHS: RoHS3; Package: 0402; ComponentLink3Description: 3_X-information; Operating temperature range: -55 ... +125°C; Manufacturer Part Number: GCM155R71H223KA55D; Component Type: Capacitor
C217 = CMP-001-000419-13: CAP_RF_MATCHING; Part Number: GJM0335C1E100GB01D; Temperature characteristics: C0G; Tolerance: +/- 2%; Remark: RF matching, use part number; Sort order: 202; HasBeenBuilt: TBD; Voltage: 25V; System: RLC; Package: 0201; Operating temperature range: -55 ... +125C; ComponentLink1Description: 1_Datasheet; ComponentLink2Description: 2_Product page; ComponentLink3Description: 3_X-information; ComponentLink4Description: 4_X-information; Creation date: 20200101; ClassName: SMALL; Manufacturer Part Number: GJM0335C1E100GB01D; Component Type: Capacitor
C218 = CMP-001-000281-14: CAP; Part Number: GRM033R71E222KA12J; Temperature characteristics: X7R; Tolerance: +/-10%; Sort order: 302; HasBeenBuilt: TBD; Alternative component: Allowed; Voltage: 25V; System: RLC; Package: 0201; ComponentLink1Description: 1_Datasheet; ComponentLink2Description: 2_Product page; ComponentLink3Description: 3_X-information; ComponentLink4Description: 4_X-information; Creation date: 20222504; ClassName: SMALL; Source: RLC_UN1Q.SchLib; Manufacturer Part Number: GRM033R71E222KA12J; Component Type: Capacitor
CR1 = SK34A-LTP: Description; Manufacturer_Name: MCC; Type: Diodes - Rectifiers, Single; Copyright: Copyright (C) 2025 Ultra Librarian. All rights reserved.; Manufacturer_Part_Number: SK34A-LTP
F1 = 0ZCF0200AF2C: 2920 SMT PPTC | 2.00 Ih | 24V; MF: Bel Fuse; SnapEDA_Link: https://www.snapeda.com/parts/0ZCF0200AF2C/Bel+Fuse+Inc./view-part/?ref=snap; Package: 2920 Bel Fuse; MP: 0ZCF0200AF2C; Check_prices: https://www.snapeda.com/parts/0ZCF0200AF2C/Bel+Fuse+Inc./view-part/?ref=eda; Purchase-URL: https://pricing.snapeda.com/search/part/0ZCF0200AF2C/?ref=eda; Digi-Key_Part_Number: 507-1749-2-ND; Value: *
J4 J5 = CMP-001-000157-12: Part Number: TP 1x2mm; System: Test Point; Sort order: -; HasBeenBuilt: -; ClassName: SMALL; ComponentLink1Description: 1_Datasheet; ComponentLink2Description: 2_Product page; ComponentLink3Description: 3_X-information; ComponentLink4Description: 4_X-information; Creation date: 20200101; Source: Conn_UN1Q.SchLib; Design Item ID: TP_1x2mm; Component Type: Test Point
J6 = PJ-002AH-SMT-TR: 2.0 x 6.5 mm, 5.0 A, Horizontal, Surface Mount (SMT), Dc Power Jack Connector; MF: Same Sky; SnapEDA_Link: https://www.snapeda.com/parts/PJ-002AH-SMT-TR/Same+Sky/view-part/?ref=snap; Package: None; Value: *; part number: PJ-002AH-SMT-TR; Check_prices: https://www.snapeda.com/parts/PJ-002AH-SMT-TR/Same+Sky/view-part/?ref=eda
L9-L11 L13 L15-L18 L20 L22 = CMP-001-000738-12: FERRITE; Part Number: BLM15KD300SN1; Manufacturer: Murata; Manufacturer Part Number: BLM15KD300SN1D; Sort order: 364; HasBeenBuilt: Saluki2; System: Discrete; Package: 0402; Operating temperature range: -55 ... +125C; Dimensions WxLxH: 0.55mm; ComponentLink1Description: 1_Datasheet; ComponentLink1URL: https://www.murata.com/en-us/products/productdetail.aspx?cate=luNoiseSupprFilteChipFerriBead&partno=BLM15KD300SN1%23; ComponentLink2Description: 2_Product page; ComponentLink3Description: 3_X-information; ComponentLink4Description: 4_X-information; Creation date: 20200304; Source: Discrete_UN1Q.SchLib; ECCN: EAR99; RoHS: RoHS3; Component Type: Ferrite
L12 L14 L21 = CMP-001-001158-1: IND, Low DCR, shielded.; Sort order: 348; System: RLC; Dimensions WxLxH: 4.3 x 4.3 x 3.1mm; ClassName: BIG; Creation date: 20250415; ComponentLink2Description: 2_Product_page; Operating temperature range: -40 ... +125 °C; ComponentLink2URL: https://www.coilcraft.com/en-us/products/power/shielded-inductors/molded-inductor/xgl/xgl4030/; ComponentLink1URL: https://www.coilcraft.com/en-us/products/power/shielded-inductors/molded-inductor/xgl/xgl4030/xgl4030-102/; ComponentLink1Description: 1_Datasheet; Package: 4030; ComponentLink4Description: 4_X-information; ComponentLink3Description: 3_X-information; Manufacturer Part Number: XGL4030-102MEC; Component Type: Inductor
L19 = CMP-001-000740-8: FERRITE; Part Number: BLM18KG260TN1; Manufacturer Part Number: BLM18KG260TN1D; Sort order: 366; System: Discrete; Package: 0603; Operating temperature range: -55 ... +125C; Dimensions WxLxH: 0.8mm; ComponentLink1Description: 1_Datasheet; ComponentLink1URL: https://www.murata.com/products/productdata/8796738650142/ENFA0003.pdf; ComponentLink2Description: 2_Product page; ComponentLink3Description: 3_X-information; ComponentLink4Description: 4_X-information; Creation date: 20200304; Component Type: Ferrite
PTP46-PTP85 = CMP-001-001296-3: Production Testpoint 0.4mm. Flying probe. Use 1mm pitch.; Part Number: PTP 0.4mm; ComponentLink4Description: 4_X-information; ComponentLink1Description: 1_Datasheet; Sort order: -; ClassName: SMALL; System: Test Point; HasBeenBuilt: -; Design Item ID: PTP_0.4mm; ComponentLink3Description: 3_X-information; Creation date: 20240909; ComponentLink2Description: 2_Product page; Component Type: Test Point
Q1 = CMP-001-001632-2: NMOS Transistor, 30V, 1.5A, 260mOhm; Manufacturer: TI; Sort order: 447; System: Discrete; Part Number: CSD17483F4; ComponentLink1Description: 1_Datasheet; ComponentLink1URL: https://www.ti.com/lit/ds/symlink/csd17483f4.pdf?ts=1762205176105; ComponentLink2Description: 2_Product page; ComponentLink2URL: https://www.ti.com/product/CSD17483F4?keyMatch=CSD17483F4&tisearch=universal_search; ComponentLink3Description: 3_X-information; ComponentLink4Description: 4_X-information; Creation date: 20251104; Dimensions WxLxH: 1.0 × 0.6 × 0.36 mm; Operating temperature range: -55 ... +150 °C; Package: 3-XFDFN, 3-PICOSTAR; ClassName: SMALL; Manufacturer Part Number: CSD17483F4; Component Type: Transistor
R48 R57 = CMP-001-001154-3: RES; Manufacturer: YAGEO; Part Number: RC0201FR-0752K3L; Alternative component: Allowed; Tolerance: 1%; System: RLC; Power Rating: 1/20W; HasBeenBuilt: TBD; Sort order: 322; ComponentLink2Description: 2_Product page; ComponentLink1Description: 1_Datasheet; Package: 0201; ComponentLink3Description: 3_X-information; Creation date: 20250716; ClassName: SMALL; ComponentLink4Description: 4_X-information; Component Type: Resistor
R49 R50 R53 R58 R59 R67 R68 R70 = CMP-001-000526-11: RES; Part Number: RC0201FR-07100KL; Manufacturer: YAGEO; Tolerance: 1%; Power Rating: 1/20W; Sort order: 322; HasBeenBuilt: TBD; Alternative component: Allowed; System: RLC; Package: 0201; ClassName: SMALL; ComponentLink1Description: 1_Datasheet; ComponentLink2Description: 2_Product page; ComponentLink3Description: 3_X-information; ComponentLink4Description: 4_X-information; Creation date: 20190101; Source: RLC_UN1Q.SchLib; Component Type: Resistor
R51 R60 = CMP-001-001155-2: RES; Part Number: RC0201FR-079K76L; Manufacturer: YAGEO; Power Rating: 1/20W; Sort order: 322; Tolerance: 1%; Alternative component: Allowed; HasBeenBuilt: TBD; System: RLC; Package: 0201; Creation date: 20250415; ComponentLink3Description: 3_X-information; ClassName: SMALL; ComponentLink1Description: 1_Datasheet; ComponentLink2Description: 2_Product page; ComponentLink4Description: 4_X-information; Component Type: Resistor
R52 = CMP-001-001153-3: RES; Manufacturer: YAGEO; Part Number: RC0201FR-0731K6L; Alternative component: Allowed; Tolerance: 1%; System: RLC; Power Rating: 1/20W; HasBeenBuilt: TBD; Sort order: 322; ComponentLink2Description: 2_Product page; ComponentLink1Description: 1_Datasheet; Package: 0201; ComponentLink3Description: 3_X-information; Creation date: 20250414; ClassName: SMALL; ComponentLink4Description: 4_X-information; Component Type: Resistor
R54 R62 = CMP-001-000446-13: RES; Part Number: RC0201FR-0710KL; Manufacturer: YAGEO; Power Rating: 1/20W; Sort order: 322; HasBeenBuilt: TBD; Tolerance: 1%; Alternative component: Allowed; System: RLC; Package: 0201; ClassName: SMALL; ComponentLink1Description: 1_Datasheet; ComponentLink2Description: 2_Product page; ComponentLink3Description: 3_X-information; ComponentLink4Description: 4_X-information; Creation date: 20190101; Source: RLC_UN1Q.SchLib; Component Type: Resistor
R55 R63 = CMP-001-001157-2: RES; Manufacturer: YAGEO; Part Number: RC0201FR-07121KL; System: RLC; Tolerance: 1%; HasBeenBuilt: TBD; Sort order: 322; Power Rating: 1/20W; Alternative component: Allowed; ComponentLink4Description: 4_X-information; ComponentLink2Description: 2_Product page; ClassName: SMALL; ComponentLink1Description: 1_Datasheet; ComponentLink3Description: 3_X-information; Creation date: 20250415; Package: 0201; Component Type: Resistor
R56 R64 R73 = CMP-001-001156-2: RES; Manufacturer: YAGEO; Part Number: RC0201FR-077K15L; Power Rating: 1/20W; Alternative component: Allowed; Tolerance: 1%; HasBeenBuilt: TBD; Sort order: 322; System: RLC; ClassName: SMALL; ComponentLink1Description: 1_Datasheet; Package: 0201; ComponentLink4Description: 4_X-information; Creation date: 20250415; ComponentLink2Description: 2_Product page; ComponentLink3Description: 3_X-information; Component Type: Resistor
R61 = CMP-001-000535-12: RES; Manufacturer: YAGEO; Part Number: RC0201FR-0712K4L; Alternative component: Allowed; Tolerance: 1%; System: RLC; Power Rating: 1/20W; HasBeenBuilt: TBD; Sort order: 322; ComponentLink2Description: 2_Product page; ComponentLink1Description: 1_Datasheet; Package: 0201; ComponentLink3Description: 3_X-information; Creation date: 20230510; Source: RLC_UN1Q.SchLib; ClassName: SMALL; ComponentLink4Description: 4_X-information; Component Type: Resistor
R65 = CMP-001-001160-1: RES; Manufacturer: YAGEO; Part Number: RC0201FR-0742K2L; Alternative component: Allowed; Tolerance: 1%; System: RLC; Power Rating: 1/20W; Sort order: 322; ComponentLink2Description: 2_Product page; ComponentLink1Description: 1_Datasheet; Package: 0201; ComponentLink3Description: 3_X-information; Creation date: 20250415; ClassName: SMALL; ComponentLink4Description: 4_X-information; Component Type: Resistor
R66 = CMP-001-001257-9: RES; Part Number: RC0201FR-0740K2L; Manufacturer: YAGEO; Power Rating: 1/20W; Sort order: 322; Tolerance: 1%; Alternative component: Allowed; System: RLC; Package: 0201; Creation date: 20240404; ComponentLink3Description: 3_X-information; ClassName: SMALL; ComponentLink1Description: 1_Datasheet; ComponentLink2Description: 2_Product page; ComponentLink4Description: 4_X-information; Component Type: Resistor
R69 = CMP-001-001161-1: RES; Part Number: RC0201FR-0713K3L; Manufacturer: YAGEO; Power Rating: 1/20W; Sort order: 322; Tolerance: 1%; Alternative component: Allowed; HasBeenBuilt: TBD; System: RLC; Package: 0201; Creation date: 20250415; ComponentLink3Description: 3_X-information; ClassName: SMALL; ComponentLink1Description: 1_Datasheet; ComponentLink2Description: 2_Product page; ComponentLink4Description: 4_X-information; Component Type: Resistor
R71 = CMP-001-000449-12: RES; Manufacturer: YAGEO; Part Number: RC0201FR-0711KL; Power Rating: 1/20W; Alternative component: Allowed; Tolerance: 1%; HasBeenBuilt: TBD; Sort order: 322; System: RLC; ClassName: SMALL; ComponentLink1Description: 1_Datasheet; Package: 0201; ComponentLink4Description: 4_X-information; Creation date: 20190101; ComponentLink2Description: 2_Product page; ComponentLink3Description: 3_X-information; Component Type: Resistor
R72 = CMP-001-001496-1: RES; Part Number: CRCW020156K2FNED; Manufacturer: Vishay Dale; Power Rating: 1/20W; Sort order: 322; HasBeenBuilt: TBD; Tolerance: 1%; Alternative component: Allowed; System: RLC; Package: 0201; ComponentLink1Description: 1_Datasheet; ComponentLink2Description: 2_Product page; ComponentLink3Description: 3_X-information; ComponentLink4Description: 4_X-information; Creation date: 20250813; ClassName: SMALL; Source: RLC_UN1Q.SchLib; Component Type: Resistor
T3 = CMP-001-000966-8: 450 W bidirectional TVS diode, 36 V / 60 V; HasBeenBuilt: Saluki3_HW_SB_2; Sort order: 402; System: IC; ComponentLink1Description: 1_Datasheet; ComponentLink1URL: https://www.littelfuse.com/assetdocs/tvs-diode-array-spa-sd-c-datasheet?assetguid=b682d4fa-3733-4cd6-9f7f-7cf1a490030b; ComponentLink2Description: 2_Product page; ComponentLink2URL: https://www.littelfuse.com/products/tvs-diode-arrays/general-purpose-esd-protection/sdc/sd36c_01ftg.aspx; Part Number: SD36C-01FTG; ClassName: SMALL; Creation date: 20230529; Dimensions WxLxH: 1.45 x 1.90 x 1.14 mm; Package: SOD323; ECCN: EAR99; ComponentLink3Description: 3_X-information; ComponentLink4Description: 4_X-information; Source: UUDET_KOMPONENTIT.SchLib; Operating temperature range: -40 .... +125 °C (Note: derating); RoHS: RoHS3; Manufacturer Part Number: SD36C-01FTG; Component Type: ESD & EMI
U7-U9 = CMP-001-001142-13: SMPS Module,  3V to 36V Input, 0.8V to 16V Dual Output, 3A+3A; Sort order: 453; System: IC; ClassName: BIG; ComponentLink1Description: 1_Datasheet; ComponentLink1URL: https://www.ti.com/lit/ds/symlink/tpsm64406.pdf?ts=1704232235164&ref_url=https%253A%252F%252Fwww.ti.com%252Fproduct%252FTPSM64406; ComponentLink2Description: 2_Product page; ComponentLink2URL: https://www.ti.com/product/TPSM64406?keyMatch=tpsm64406&tisearch=universal_search#design-development; Creation date: 20250407; Dimensions WxLxH: 6.6x7.2x2.1mm; Operating temperature range: -40C ... +125C; Package: QFN-FCMOD-28; Part Number: TPSM64406RCHR; ECCN: EAR99; Design Item ID: TPSM63602RDHR; ComponentLink3Description: 3_Package; ComponentLink3URL: https://www.ti.com/lit/ml/mpqf746/mpqf746.pdf?ts=1744029691982&ref_url=https%253A%252F%252Fwww.ti.com%252Fproduct%252FTPSM64406%253FkeyMatch%253Dtpsm64406%2526tisearch%253Duniversal_search; ComponentLink4Description: 4_X-information; RoHS: RoHS 3; Manufacturer Part Number: TPSM64406RCHR; Component Type: Power Supply